# Altium project Arribada-PMP.PrjPCB
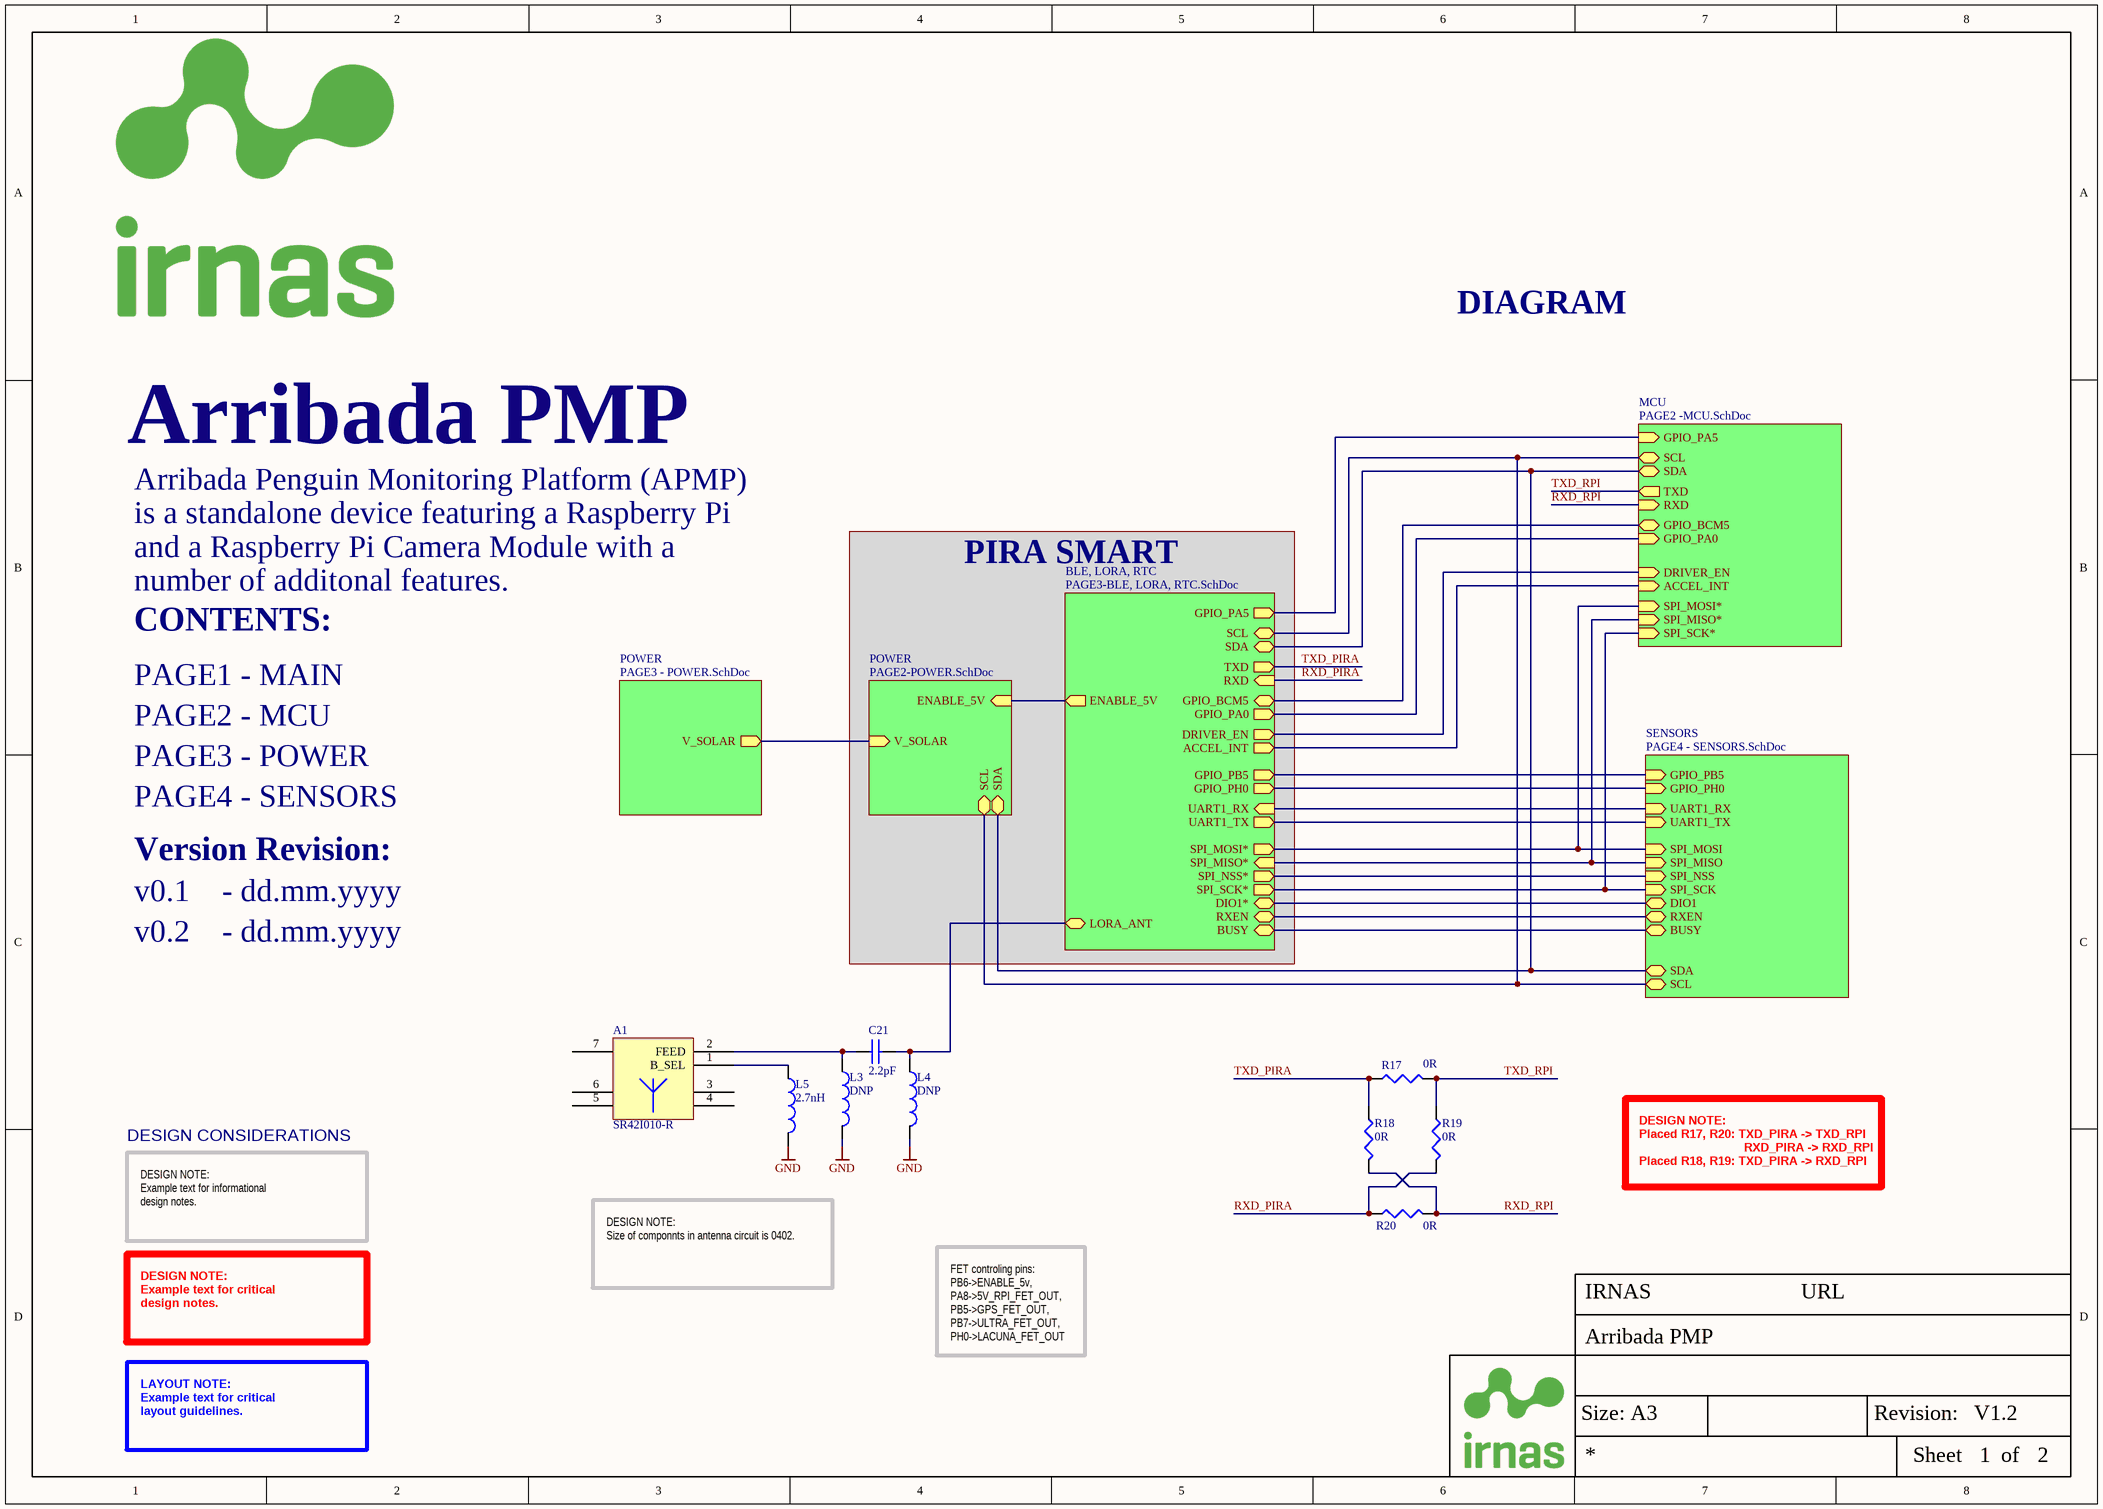
[diagram p0: PAGE1 - MAIN.SchDoc]
Company: IRNAS; CreateDate: 13.09.2019; PCBDesigner: Tadej Plej; ProjectTitle: Arribada PMP; RevisionDate: 14.11.2019; Version: V1.2; Website: URL
4 sheets, 78 parts. Net scope: hierarchical (ports join the sheet entries above them; power ports are global).
Board file: Arribada-PMP-PCB.PcbDoc
Sheets:
  PAGE1 - MAIN.SchDoc
    POWER = PAGE3 - POWER.SchDoc
    SENSORS = PAGE4 - SENSORS.SchDoc
    MCU = PAGE2 -MCU.SchDoc

## Sheet PAGE1 - MAIN.SchDoc
size A3; DocumentNumber: 1; SheetNumber: 1; SheetTotal: 2

### Parts
A1  SR42I010-R  [LORA_PCB_ANTENNA]
C21  2.2pF  [CAP0402]
L3  DNP  [IND0402]
L4  DNP  [IND0402]
L5  2.7nH  [IND0402]
R17  0R  [RES0603]
R18  0R  [RES0603]
R19  0R  [RES0603]
R20  0R  [RES0603]

### Sub-sheets
BLE, LORA, RTC = PAGE3-BLE, LORA, RTC.SchDoc (file not in this document): ENABLE_5V (out), SDA (bidir), UART1_RX (in), SCL (bidir), UART1_TX (out), GPIO_PH0 (out), GPIO_PA5 (out), LORA_ANT (bidir), GPIO_PB5 (out), SPI_MOSI* (out), SPI_MISO* (in), SPI_SCK* (out), DIO1* (bidir), SPI_NSS* (out), TXD (out), RXD (in), GPIO_BCM5 (bidir), RXEN (bidir), BUSY (bidir), GPIO_PA0 (out), DRIVER_EN (out), ACCEL_INT (out)
MCU = PAGE2 -MCU.SchDoc: SDA (bidir), GPIO_PA5 (in), SCL (bidir), TXD (out), GPIO_BCM5 (bidir), RXD (in), GPIO_PA0 (in), DRIVER_EN (in), ACCEL_INT (in), SPI_MISO* (in), SPI_MOSI* (in), SPI_SCK* (in)
POWER = PAGE3 - POWER.SchDoc: V_SOLAR (out)
POWER = PAGE2-POWER.SchDoc (file not in this document): ENABLE_5V (in), SCL (bidir), SDA (bidir), V_SOLAR (in)
SENSORS = PAGE4 - SENSORS.SchDoc: SDA (bidir), GPIO_PH0 (in), UART1_RX (in), SPI_SCK (in), SPI_NSS (in), UART1_TX (in), SCL (bidir), GPIO_PB5 (in), DIO1 (bidir), SPI_MISO (in), SPI_MOSI (in), RXEN (bidir), BUSY (bidir)

### Nets
GND: L3.1 L4.1 L5.1
ACCEL_INT: sheet MCU/ACCEL_INT, sheet BLE, LORA, RTC/ACCEL_INT
BUSY: sheet SENSORS/BUSY, sheet BLE, LORA, RTC/BUSY
DIO1: sheet SENSORS/DIO1, sheet BLE, LORA, RTC/DIO1*
DRIVER_EN: sheet MCU/DRIVER_EN, sheet BLE, LORA, RTC/DRIVER_EN
GPIO_BCM5: sheet MCU/GPIO_BCM5, sheet BLE, LORA, RTC/GPIO_BCM5
GPIO_PA0: sheet MCU/GPIO_PA0, sheet BLE, LORA, RTC/GPIO_PA0
GPIO_PA5: sheet MCU/GPIO_PA5, sheet BLE, LORA, RTC/GPIO_PA5
GPIO_PB5: sheet SENSORS/GPIO_PB5, sheet BLE, LORA, RTC/GPIO_PB5
GPIO_PH0: sheet SENSORS/GPIO_PH0, sheet BLE, LORA, RTC/GPIO_PH0
GPS_RX: sheet SENSORS/UART1_TX, sheet BLE, LORA, RTC/UART1_TX
GPS_TX: sheet SENSORS/UART1_RX, sheet BLE, LORA, RTC/UART1_RX
RXD_PIRA: R19.2 R20.1 ; sheet BLE, LORA, RTC/RXD
RXD_RPI: R18.2 R20.2 ; sheet MCU/RXD
RXEN: sheet SENSORS/RXEN, sheet BLE, LORA, RTC/RXEN
SCL: sheet SENSORS/SCL, sheet MCU/SCL, sheet POWER/SCL, sheet BLE, LORA, RTC/SCL
SDA: sheet SENSORS/SDA, sheet MCU/SDA, sheet POWER/SDA, sheet BLE, LORA, RTC/SDA
SPI_MISO: sheet SENSORS/SPI_MISO, sheet MCU/SPI_MISO*, sheet BLE, LORA, RTC/SPI_MISO*
SPI_MOSI: sheet SENSORS/SPI_MOSI, sheet MCU/SPI_MOSI*, sheet BLE, LORA, RTC/SPI_MOSI*
SPI_NSS: sheet SENSORS/SPI_NSS, sheet BLE, LORA, RTC/SPI_NSS*
SPI_SCK: sheet SENSORS/SPI_SCK, sheet MCU/SPI_SCK*, sheet BLE, LORA, RTC/SPI_SCK*
TXD_PIRA: R17.1 R18.1 ; sheet BLE, LORA, RTC/TXD
TXD_RPI: R17.2 R19.1 ; sheet MCU/TXD
V_SOLAR: sheet POWER/V_SOLAR, sheet POWER/V_SOLAR
NetA1_1: A1.1(B_SEL) L5.2
NetA1_2: A1.2(FEED) C21.1 L3.2
NetC21_2: C21.2 L4.2 ; sheet BLE, LORA, RTC/LORA_ANT
(unnamed): sheet POWER/ENABLE_5V, sheet BLE, LORA, RTC/ENABLE_5V

Not connected (* = marked no-connect by the designer): A1 3 4 5 6 7

### Notes on the sheet
- DIAGRAM
- Arribada Penguin Monitoring Platform (APMP)
- is a standalone device featuring a Raspberry Pi
- and a Raspberry Pi Camera Module with a
- PIRA SMART
- CONTENTS:
- number of additonal features.
- PAGE1 - MAIN
- PAGE2 - MCU
- PAGE3 - POWER
- PAGE4 - SENSORS
- Version Revision:
- v0.1    - dd.mm.yyyy
- v0.2    - dd.mm.yyyy
- DESIGN CONSIDERATIONS
- DESIGN NOTE:
  Placed R17, R20: TXD_PIRA -> TXD_RPI
  RXD_PIRA -> RXD_RPI
  Placed R18, R19: TXD_PIRA -> RXD_RPI
  RXD_PIRA -> TXD_RPI
- DESIGN NOTE:
  Example text for informational
  design notes.
- DESIGN NOTE:
  Example text for critical
  design notes.
- DESIGN NOTE:
  Size of componnts in antenna circuit is 0402.
- FET controling pins:
  PB6->ENABLE_5v,
  PA8->5V_RPI_FET_OUT,
  PB5->GPS_FET_OUT,
  PB7->ULTRA_FET_OUT,
  PH0->LACUNA_FET_OUT
- LAYOUT NOTE:
  Example text for critical
  layout guidelines.
- Size: A3
- Revision:
- Sheet
- of

### Library data of the parts
A1 = ANT - SR42I010-R_1: Antenna SMD -4dBi Gain 870MHz/928MHz Automotive 7-Pin SMD T/R; Manufacturer: Antenova; Supplier 1: Mouser; Manufacturer Part Number: SR42I010-R; Stock 1: 3154; Pricing 1: 1 = 2.36000, 10 = 1.90000, 50 = 1.90000, 100 = 1.52000, 1000 = 1.07000, 10000 = 0.95900 (USD); Supplier Part Number 1: 237-SR42I010-R
C21 = C - 1.8pF/0402: Multilayer Ceramic Capacitors MLCC - SMD/SMT 50volts 1.8pF C0G; Manufacturer: KEMET; Manufacturer Part Number: C0402C189B5GACTU; IRNAS Part No.: /; Voltage Rating: 50V; Stock 1: 8950; Pricing 1: 10=0.463, 100=0.248, 500=0.182, 2500=0.153, 5000=0.134, 10000=0.11, 50000=0.0961 (EUR); Case/Package: 0402; Case Code (Imperial): 0402; Case Code (Metric): 1005; Dielectric Material: Ceramic; Min Operating Temperature: -55°C; Max Operating Temperature: 125°C; Packaging: Tape and Reel; Voltage Rating (DC): 50V; Capacitance: 1.8pF; Termination: SMD/SMT; Lead Free: Lead Free; ComponentLink1URL: https://datasheet.ciiva.com/5413/kem-c1003-c0g-smd-5413366.pdf; ComponentLink1Description: https://datasheet.ciiva.com/5413/kem-c1003-c0g-smd-5413366.pdf; Supplier 1: Farnell; Supplier Part Number 1: 2627398
L3-L5 = L - 4.3nH/0402: Inductor RF Chip Multi-Layer 4.3nH 0.3nH 100MHz 8Q-Factor Air 300mA 210mOhm DCR 0402 Paper T/R; Manufacturer: Murata; Manufacturer Part Number: LQG15HN4N3S02D; IRNAS Part No.: /; Q Factor: 8; Self Resonant Frequency: 6GHz; Shielding: Unshielded; DC Resistance (DCR): 210mR; Stock 1: 3502; Pricing 1: 1 = 0.10000, 10 = 0.06100, 100 = 0.04040, 500 = 0.03366, 1000 = 0.02827, 2500 = 0.02423 (USD); RoHS: Yes; Mount: Surface Mount; Case/Package: 0402; Core Material: Air; Case Code (Metric): 1005; Case Code (Imperial): 0402; Min Operating Temperature: -55°C; Max Operating Temperature: 125°C; Package Quantity: 10000; Packaging: Tape and Reel; Current Rating: 300mA; Inductance: 4.3nh; Test Frequency: 100MHz; Max DC Current: 300mA; Termination: SMD/SMT; Current: 300mA; DC Current: 300mA; Military Standard: Not; Length: 1.05mm; Height: 0.5mm; Width: 0.02inch; Height - Seated (Max): 0.022inch; Depth: 0.55mm; Radiation Hardening: No; REACH SVHC: No SVHC; Lead Free: Lead Free; ComponentLink1URL: http://uk.rs-online.com/webdocs/0f10/0900766b80f10808.pdf?src-supplier=RSComponents; ComponentLink1Description: http://uk.rs-online.com/webdocs/0f10/0900766b80f10808.pdf?src-supplier=RSComponents; ComponentLink2URL: http://search.murata.co.jp/Ceramy/image/img/PDF/ENG/L0075S0083LQG15HN.pdf?src-supplier=Avnet; ComponentLink2Description: http://search.murata.co.jp/Ceramy/image/img/PDF/ENG/L0075S0083LQG15HN.pdf?src-supplier=Avnet; ComponentLink3URL: http://www.farnell.com/datasheets/66026.pdf?src-supplier=Element14; ComponentLink3Description: http://www.farnell.com/datasheets/66026.pdf?src-supplier=Element14; ComponentLink4URL: https://www.verical.com/server-webapp/html/getDatasheet?partID=31252&src-supplier=Verical; ComponentLink4Description: https://www.verical.com/server-webapp/html/getDatasheet?partID=31252&src-supplier=Verical; ComponentLink5URL: http://search.murata.co.jp/Ceramy/image/img/PDF/ENG/L0075S0083LQG15HN.pdf?src-supplier=Avnet+Europe; ComponentLink5Description: http://search.murata.co.jp/Ceramy/image/img/PDF/ENG/L0075S0083LQG15HN.pdf?src-supplier=Avnet+Europe; ComponentLink6URL: https://search.murata.co.jp/Ceramy/image/img/P02/partnumberingAT_LQ3E.pdf?src-supplier=Digi-Key; ComponentLink6Description: https://search.murata.co.jp/Ceramy/image/img/P02/partnumberingAT_LQ3E.pdf?src-supplier=Digi-Key; Supplier 1: Farnell
  L3 L4: Supplier Part Number 1: 1711735
  L5: Supplier Part Number 1: 1343066
R17-R20 = R - 0R: BOURNS - CR0603-J/-000ELF - RES, THICK FILM, 0R, 5%, 0.1W, 0603; IRNAS Part No.: I-100011; Resistance: 0; Voltage Rating: 50; Resistor Case Style: 0603 [1608 Metric]; Power Rating: 100; Product Range: CR Series; SVHC: No SVHC (17-Dec-2015); Resistor Mounting: Surface Mount Device<!--FANDB--><div class="features-and-benefits-container"><div class="features-and-benefits-description"><span class="features-benefits-value">The Bourns CR series are standard thick film chip resistors. These resistors provide flexibility of performance, space saving and low cost. The Resistance range includes E96 and E24 decade values from 1ohm to 10Mohm.</span></div><div class="features-and-benefits-list"><ul class="features-and-benefits-list-list"><li class="features-and-benefits-list-item">0201, 0402, 0603, 0805, 1206, 1210, 2010, 2512 standard case sizes available</li><li class="features-and-benefits-list-item">±1% and ±5% tolerance</li><li class="features-and-benefits-list-item">±100ppm/°C, ±200ppm/°C and ±250ppm/°C TCR values available</li><li class="features-and-benefits-list-item">Power rating selectable for 50mW, 63mW, 0.1W, 0.125W, 0.25W, 0.5W and 1W based on ordering</li><li class="features-and-benefits-list-item">Jumpers are available for all size</li><li class="features-and-benefits-list-item">3 layer termination process with nickel barrier prevents leaching & provides excellent solderability</li><li class="features-and-benefits-list-item">Suitable for all type of soldering processes</li><li class="features-and-benefits-list-item">Tight dimensional tolerances</li><li class="features-and-benefits-list-item">Maximum working voltage depends on case size</li><li class="features-and-benefits-list-item">Operating temperature of -55°C to +125°C(CR0201) and -55°C to +155; Supplier 1: Farnell; Manufacturer: BOURNS; Manufacturer Part Number: CR0603-J/-000ELF; RoHS: YES; Stock 1: 58200; Pricing 1: 10=0.0146, 250=0.0097, 1000=0.0073, 5000=0.0049, 12500=0.0042 (GBP); Resistance Tolerance: ± 5%; Packaging: Cut Tape; Resistor Element Material: Thick Film; Temperature Coefficient: -; Automotive Qualification Standard: -; MSL: MSL 1 - Unlimited; ComponentLink1URL: http://www.bourns.com/engineering/CHPREZTR/cr0603.stp; ComponentLink1Description: http://www.bourns.com/engineering/CHPREZTR/cr0603.stp; ComponentLink2URL: http://www.farnell.com/datasheets/2178762.pdf; ComponentLink2Description: http://www.farnell.com/datasheets/2178762.pdf; Supplier Part Number 1: 2008343

## Sheet PAGE3 - POWER.SchDoc
size A3; DocumentNumber: 1; SheetNumber: 3; SheetTotal: 2
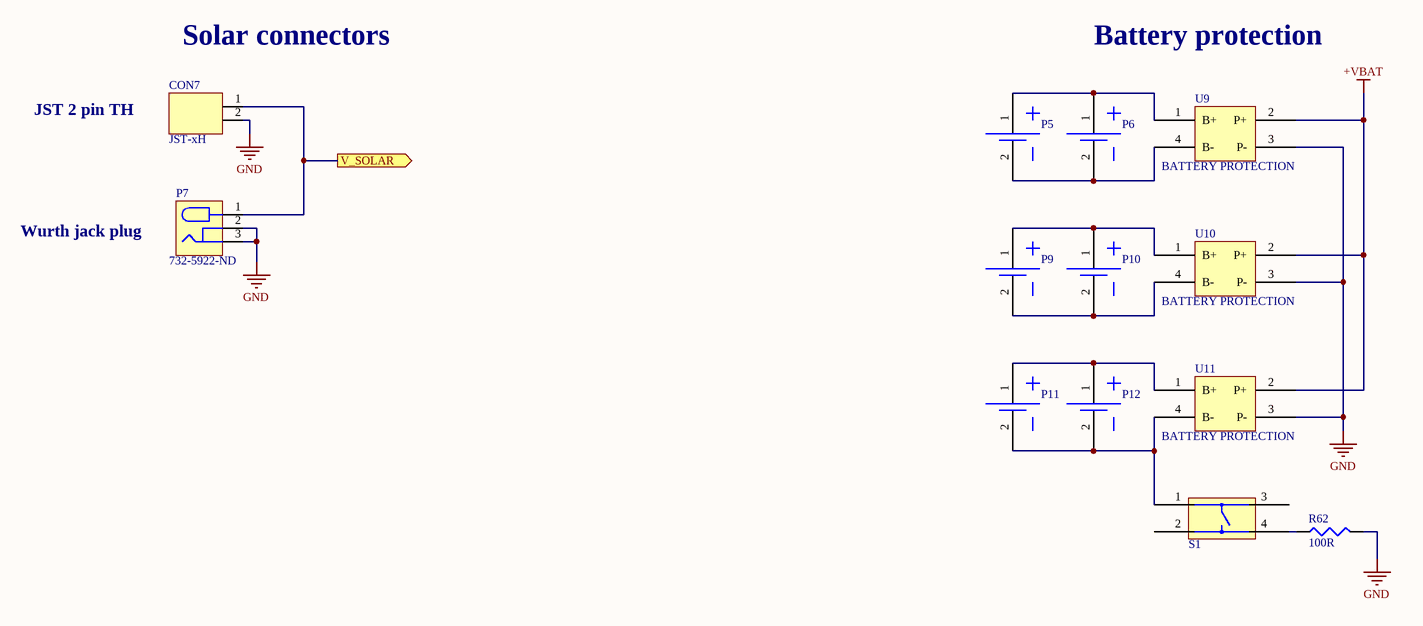
[diagram p1: PAGE3 - POWER.SchDoc]

### Parts
CON7  JST-xH  [JST_2PIN_TH]
P5  BAT - 18650  [BATTERY HOLDER 18650]  (value not drawn)
P6  BAT - 18650  [BATTERY HOLDER 18650]  (value not drawn)
P7  732-5922-ND  [732-5922-ND]
P9  BAT - 18650  [BATTERY HOLDER 18650]  (value not drawn)
P10  BAT - 18650  [BATTERY HOLDER 18650]  (value not drawn)
P11  BAT - 18650  [BATTERY HOLDER 18650]  (value not drawn)
P12  BAT - 18650  [BATTERY HOLDER 18650]  (value not drawn)
R62  100R  [RES0603]
S1  BTN - KMR221NGLFS  [SW]  (value not drawn)
U9  BATTERY PROTECTION  [BATTERY PROTECTION]
U10  BATTERY PROTECTION  [BATTERY PROTECTION]
U11  BATTERY PROTECTION  [BATTERY PROTECTION]

### Ports
V_SOLAR (out)

### Nets
+VBAT: U9.2(P+) U10.2(P+) U11.2(P+)
GND: CON7.2 P7.2 P7.3 R62.2 U9.3(P-) U10.3(P-) U11.3(P-)
V_SOLAR: CON7.1 P7.1 ; port V_SOLAR
NetP5_1: P5.1 P6.1 U9.1(B+)
NetP5_2: P5.2 P6.2 U9.4(B-)
NetP9_1: P9.1 P10.1 U10.1(B+)
NetP9_2: P9.2 P10.2 U10.4(B-)
NetP11_1: P11.1 P12.1 U11.1(B+)
NetP11_2: P11.2 P12.2 S1.1 U11.4(B-)
NetR62_1: R62.1 S1.4

Not connected (* = marked no-connect by the designer): S1 2 3

### Notes on the sheet
- Solar connectors
- Battery protection
- JST 2 pin TH
- Wurth jack plug
- Size: A3
- Revision:
- Sheet
- of

### Library data of the parts
CON7 = B2B-XH-A (LF)(SN): Wire-To-Board Connector, Vertical, 2.5 mm, 2 Contacts, Header, XH Series, Through Hole, 1 Rows; ComponentLink1Description: Datasheet; ComponentLink1URL: http://www.farnell.com/datasheets/2057209.pdf?_ga=2.26100990.2144023421.1568612611-1741076818.1563951383; Supplier 1: Farnell; Supplier Part Number 1: 1516276
P5 P6 P9-P12 = BAT - 18650: BATERRY HOLDER 18650; Supplier Part Number 1: Battery holder for 18650
P7 = CONN PWR JACK 1.05X3.5MM: Power Barrel Connector Jack 1.05mm ID (0.041"), 3.50mm OD (0.138") Through Hole, Right Angle; ComponentLink1Description: Datasheet; ComponentLink1URL: https://katalog.we-online.de/em/datasheet/6941xx303002.pdf; Supplier 1: Farnell; Supplier Part Number 1: 2472141
R62 = R - 100R: MULTICOMP - MC0063W06031100R - RES, THICK FILM, 100R, 1%, 0.063W, 0603; IRNAS Part No.: I-100009; Resistance: 100; Voltage Rating: 50; Resistor Case Style: 0603 [1608 Metric]; Power Rating: 63; Product Range: MC Series; Temperature Coefficient: ± 200; SVHC: No SVHC (12-Jan-2017); External Depth: 0.45; External Length / Height: 1.6; External Width: 0.8; No. of Pins: 2; Reel Quantity: 5000; Resistor Mounting: Surface Mount Device; Temperature Coeff. +: 200; Voltage Rating V DC: 50V<!--FANDB--><div class="features-and-benefits-container"><div class="features-and-benefits-description"><span class="features-benefits-value">The Multicomp MC series current sense resistors are thick film chip resistors. The resistance range includes E96 and E24 decade values from 1ohm to 10Mohm.</span></div><div class="features-and-benefits-list"><ul class="features-and-benefits-list-list"><li class="features-and-benefits-list-item">EIA 0402, 0603, 0805, 1206 chip sizes available</li><li class="features-and-benefits-list-item">Small size and low weight</li><li class="features-and-benefits-list-item">Suitable for both wave and reflow soldering</li><li class="features-and-benefits-list-item">Reduction of assembly costs</li><li class="features-and-benefits-list-item">Maximum working voltage of 50V(0402, 0603), 150V(0805), 200V(1206)</li><li class="features-and-benefits-list-item">Available in ±1%, ±2% and ±5% tolerance</li><li class="features-and-benefits-list-item">Power rating of 62.5mW, 100mW and 125mW</li><li class="features-and-benefits-list-item">±400ppm/°C(1ohm to 10ohm), ±200ppm/°C(11ohm to 100ohm), ±100; Supplier 1: Farnell; Manufacturer: MULTICOMP; Manufacturer Part Number: MC0063W06031100R; RoHS: Y-EX; Stock 1: 78152; Pricing 1: 10=0.0011, 100=0.001, 500=0.0009, 1000=0.0008, 2500=0.0007 (GBP); Resistance Tolerance: ± 1%; Packaging: Cut Tape; Resistor Element Material: Thick Film; Automotive Qualification Standard: -; Operating Temperature Max: 155; Operating Temperature Min: -55; Operating Temperature Range: -55°C to +155; Tape Width: 8; Temperature Coeff. -: 200; Tolerance +: 1%; Tolerance -: 1%; ComponentLink1URL: http://www.farnell.com/datasheets/1788326.pdf; ComponentLink1Description: http://www.farnell.com/datasheets/1788326.pdf; ComponentLink2URL: http://www.farnell.com/cad/1561149.zip; ComponentLink2Description: http://www.farnell.com/cad/1561149.zip; ComponentLink3URL: http://www.farnell.com/datasheets/2289252.pdf; ComponentLink3Description: http://www.farnell.com/datasheets/2289252.pdf; Supplier Part Number 1: 9330364
S1 = BTN - KMR221NGLFS: SWITCH TACTILE SPST-NO 0.05A 32V; Manufacturer: ITT C&K; Mechanical Life: 200000Cycles; Throw Configuration: SPST; Operating Force: 2N; Max Current Rating: 50mA; Power Rating: 1W; Illumination Type: Non-Illuminated; Switch Travel: 0.25mm; Switch Function: Off-Mom; Actuator Type: Standard; Actuator Length: 0.5mm; Supplier 1: Farnell; Manufacturer Part Number: KMR221NGLFS; Stock 1: 3038; Pricing 1: 10 = 0.29100, 500 = 0.27600, 1000 = 0.21800, 5000 = 0.18500, 10000 = 0.18100 (GBP); RoHS: Yes; Mount: Surface Mount; Case/Package: SMD/SMT; Contact Material: Silver; Contact Plating: Silver; Min Operating Temperature: -40°C; Max Operating Temperature: 85°C; Voltage Rating (DC): 32V; Packaging: Tape and Reel; Package Quantity: 1; Max Voltage Rating (DC): 32V; Current Rating: 50mA; Termination: Gull Wing; Orientation: Straight; Length: 2.8mm; Depth: 4.6mm; Radiation Hardening: No; Lead Free: Lead Free; ComponentLink1URL: https://www.ckswitches.com/media/1479/kmr2.pdf?src-supplier=Digi-Key; ComponentLink1Description: https://www.ckswitches.com/media/1479/kmr2.pdf?src-supplier=Digi-Key; ComponentLink2URL: http://www.ck-components.com/14414/kmr2_9aug12.pdf/?src-supplier=Avnet+Europe; ComponentLink2Description: http://www.ck-components.com/14414/kmr2_9aug12.pdf/?src-supplier=Avnet+Europe; ComponentLink3URL: http://www1.futureelectronics.com/doc/C%20-%20K%20COMPONENTS/KMR221NGLFS.pdf?src-supplier=Future+Electronics; ComponentLink3Description: http://www1.futureelectronics.com/doc/C%20-%20K%20COMPONENTS/KMR221NGLFS.pdf?src-supplier=Future+Electronics; Supplier Part Number 1: 2845727
U9-U11 = BATTERY PROTECTION: Supplier Part Number 1: Battery protection

## Sheet PAGE4 - SENSORS.SchDoc
size A3; DocumentNumber: 1; SheetNumber: 4; SheetTotal: 2
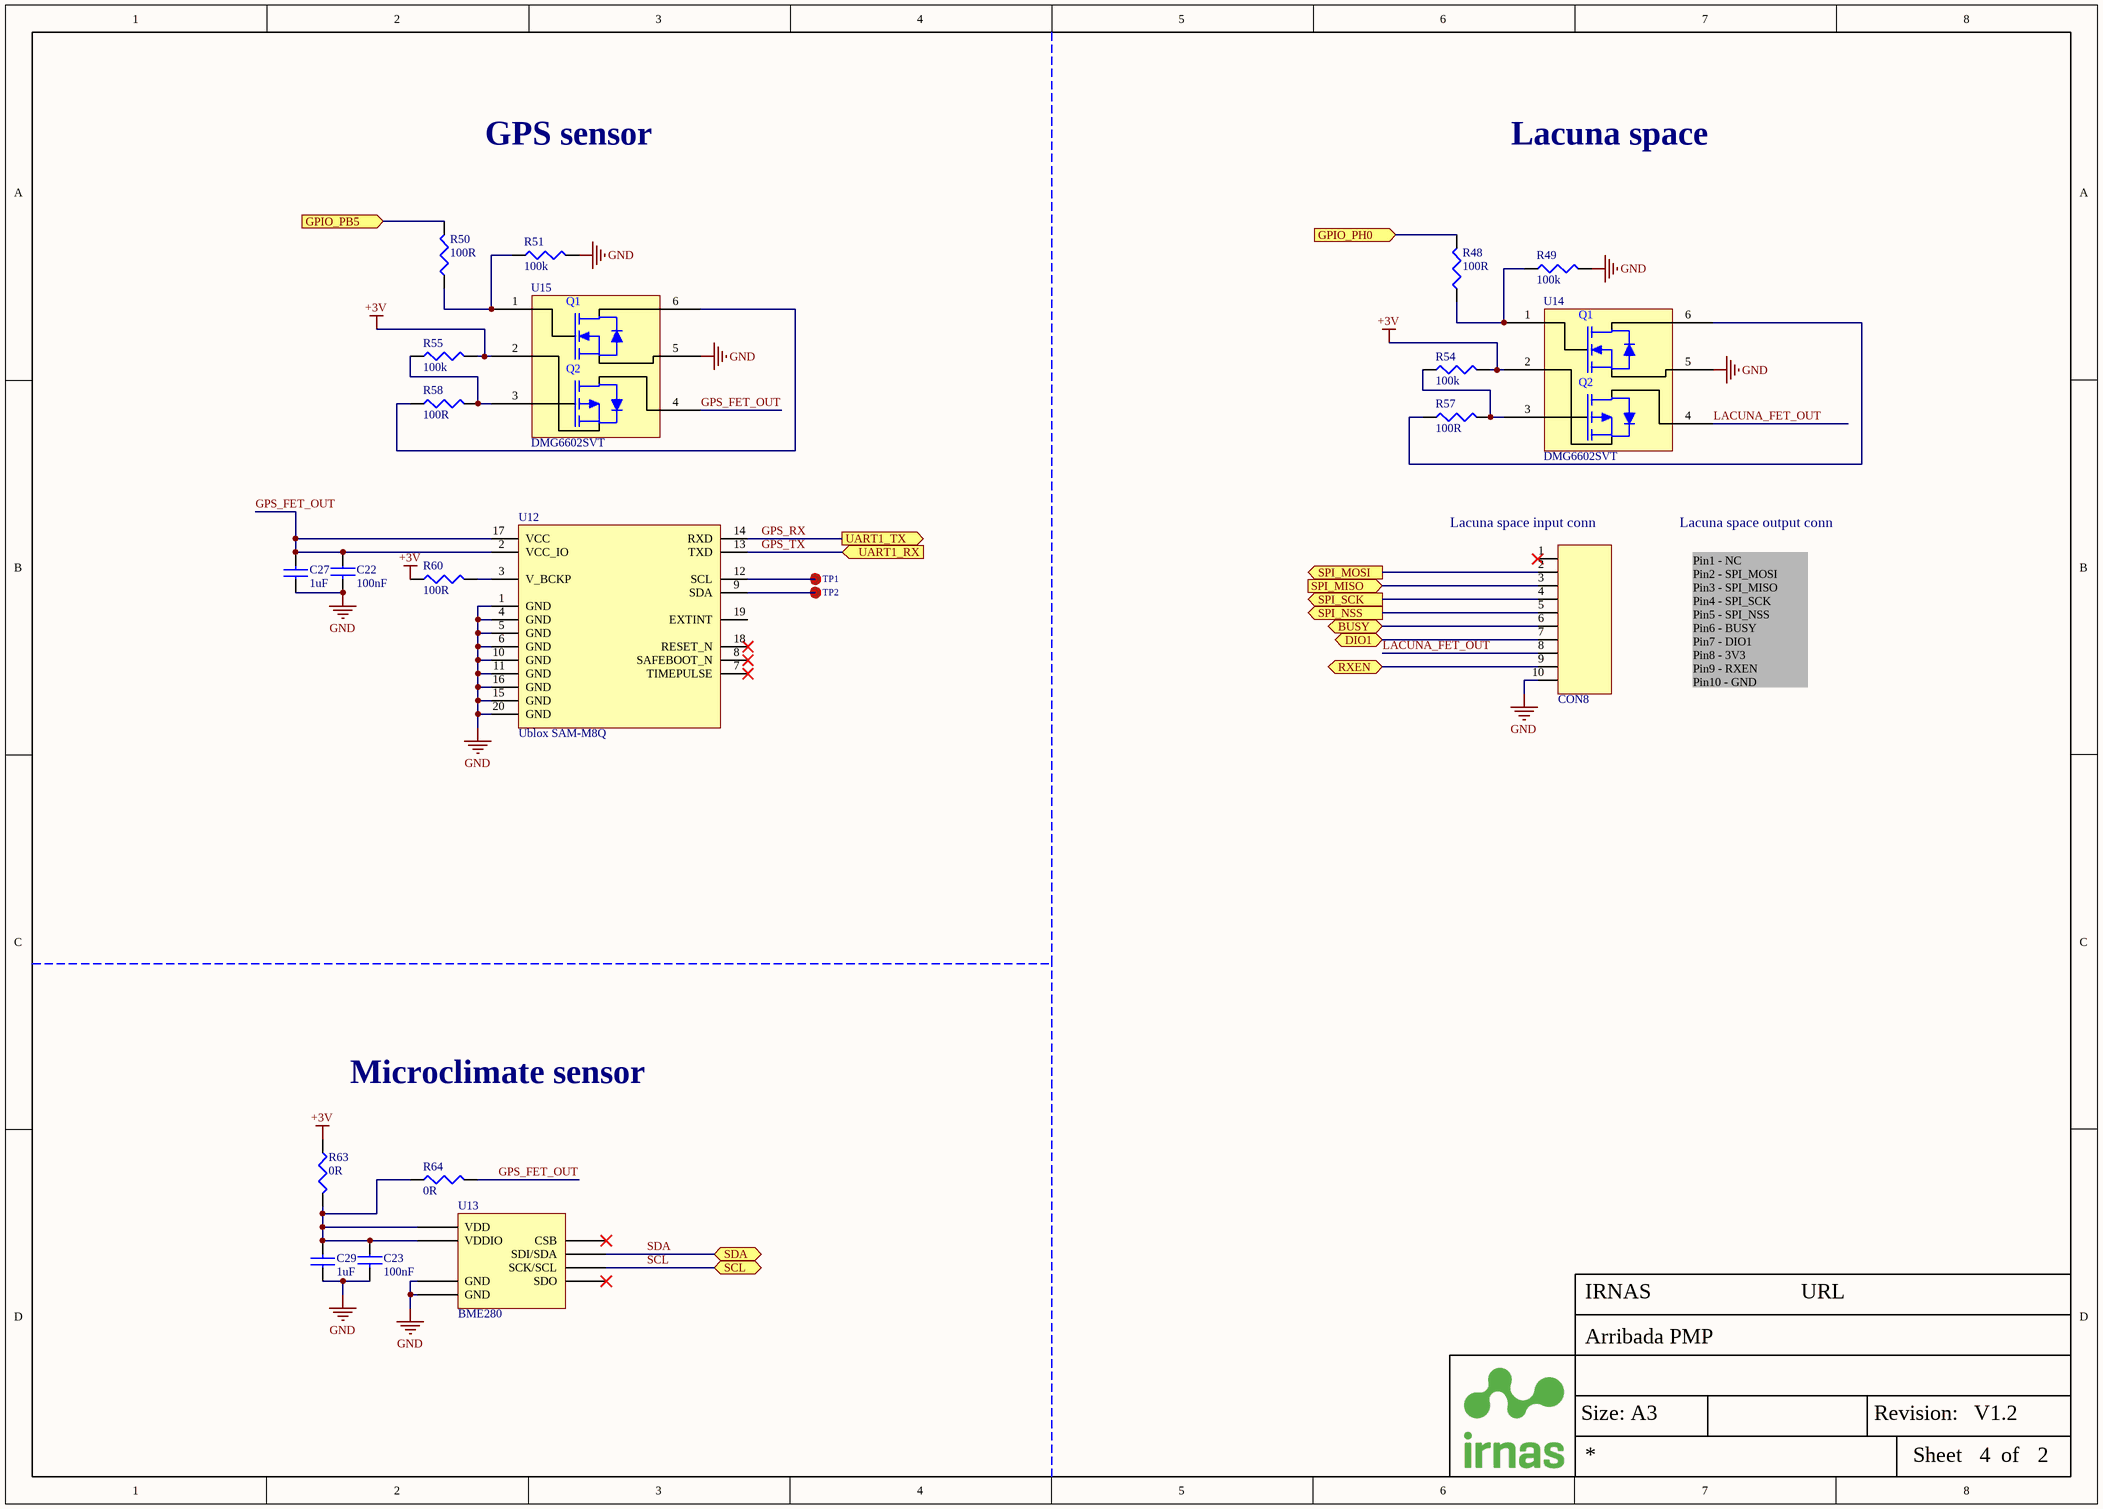
[diagram p2: PAGE4 - SENSORS.SchDoc]

### Parts
C22  100nF  [CAP0603]
C23  100nF  [CAP0603]
C27  1uF  [CAP0603]
C29  1uF  [CAP0603]
CON8  53261-1071  [PICOBLADE 10PIN]  (value not drawn)
R48  100R  [RES0603]
R49  100k  [RES0603]
R50  100R  [RES0603]
R51  100k  [RES0603]
R54  100k  [RES0603]
R55  100k  [RES0603]
R57  100R  [RES0603]
R58  100R  [RES0603]
R60  100R  [RES0603]
R63  0R  [RES0603]
R64  0R  [RES0603]
TP1  TestPoint  [TestPoint:1.2x1.2mm]  (value not drawn)
TP2  TestPoint  [TestPoint:1.2x1.2mm]  (value not drawn)
U12  Ublox SAM-M8Q  [SAM-M8Q]
U13  BME280  [BME280]
U14  DMG6602SVT  [TSOT26]
U15  DMG6602SVT  [TSOT26]

### Ports
BUSY (bidir), DIO1 (bidir), GPIO_PB5 (in), GPIO_PH0 (in), RXEN (bidir), SCL (bidir), SDA (bidir), SPI_MISO (in), SPI_MOSI (out), SPI_NSS (out), SPI_SCK (out), UART1_RX (in), UART1_TX (out)

### Nets
+3V: R54.2 R55.2 R60.1 R63.1 U14.2(S2) U15.2(S2)
GND: C22.2 C23.2 C27.1 C29.1 CON8.10 R49.2 R51.2 U12.1(GND) U12.4(GND) U12.5(GND) U12.6(GND) U12.10(GND) U12.11(GND) U12.15(GND) U12.16(GND) U12.20(GND) U13.1(GND) U13.7(GND) U14.5(S1) U15.5(S1)
BUSY: CON8.6 ; port BUSY
DIO1: CON8.7 ; port DIO1
GPIO_PB5: R50.2 ; port GPIO_PB5
GPIO_PH0: R48.2 ; port GPIO_PH0
GPS_FET_OUT: C22.1 C27.2 R64.2 U12.2(VCC_IO) U12.17(VCC) U15.4(D2)
GPS_RX: U12.14(RXD) ; port UART1_TX
GPS_TX: U12.13(TXD) ; port UART1_RX
LACUNA_FET_OUT: CON8.8 U14.4(D2)
RXEN: CON8.9 ; port RXEN
SCL: U13.4(SCK/SCL) ; port SCL
SDA: U13.3(SDI/SDA) ; port SDA
SPI_MISO: CON8.3 ; port SPI_MISO
SPI_MOSI: CON8.2 ; port SPI_MOSI
SPI_NSS: CON8.5 ; port SPI_NSS
SPI_SCK: CON8.4 ; port SPI_SCK
NetC23_1: C23.1 C29.2 R63.2 R64.1 U13.6(VDDIO) U13.8(VDD)
NetR48_1: R48.1 R49.1 U14.1(G1)
NetR50_1: R50.1 R51.1 U15.1(G1)
NetR54_1: R54.1 R57.2 U14.3(G2)
NetR55_1: R55.1 R58.2 U15.3(G2)
NetR57_1: R57.1 U14.6(D1)
NetR58_1: R58.1 U15.6(D1)
NetR60_2: R60.2 U12.3(V_BCKP)
NetTP1_0: TP1.0 U12.12(SCL)
NetTP2_0: TP2.0 U12.9(SDA)

Not connected (* = marked no-connect by the designer): CON8 1*; U12 7(TIMEPULSE)* 8(SAFEBOOT_N)* 18(RESET_N)* 19(EXTINT); U13 2(CSB)* 5(SDO)*

### Notes on the sheet
- GPS sensor
- Lacuna space
- (near CON8) Lacuna space input conn
- Lacuna space output conn
- Pin1 - NC
  Pin2 - SPI_MOSI
  Pin3 - SPI_MISO
  Pin4 - SPI_SCK
  Pin5 - SPI_NSS
  Pin6 - BUSY
  Pin7 - DIO1
  Pin8 - 3V3
  Pin9 - RXEN
  Pin10 - GND
- Microclimate sensor
- Size: A3
- Revision:
- Sheet
- of
- (in symbol T_M - DMG6602SVT) Q1; Q2

### Library data of the parts
C22 C23 = C - 100nF: MURATA - GRM188R71C104KA01J - CAP, MLCC, X7R, 0.1UF, 16V, 0603; IRNAS Part No.: I-200005; Ceramic Capacitor Case: 0603 [1608 Metric]; Capacitance: 0.1; Voltage Rating: 16; Capacitance Tolerance: ± 10%; Dielectric Characteristic: X7; Product Range: GRM Series; SVHC: No SVHC (20-Jun-2016; Supplier 1: Farnell; Manufacturer: MURATA; Manufacturer Part Number: GRM188R71C104KA01J; RoHS: YES; Stock 1: 18297; Pricing 1: 10=0.0145, 100=0.0126, 500=0.0081, 2500=0.0059, 5000=0.0052, 10000=0.0046, 50000=0.0036, 100000=0.0035 (GBP); Packaging: Cut Tape; Operating Temperature Min: -55; Operating Temperature Max: 125; Automotive Qualification Standard: -; MSL: MSL 1 - Unlimited; ComponentLink1URL: http://www.farnell.com/datasheets/2189124.pdf; ComponentLink1Description: http://www.farnell.com/datasheets/2189124.pdf; Supplier Part Number 1: 2688519
C27 C29 = C - 1uF: MURATA - GRM188R61H105KAALD - CAP, MLCC, X5R, 1UF, 50V, 0603; IRNAS Part No.: I-200006; Ceramic Capacitor Case: 0603 [1608 Metric]; Capacitance: 1; Voltage Rating: 50; Capacitance Tolerance: ± 10%; Dielectric Characteristic: X5; Product Range: GRM Series; SVHC: No SVHC (17-Dec-2015); Capacitor Terminals: SMD<!--FANDB--><div class="features-and-benefits-container"><div class="features-and-benefits-description"><span class="features-benefits-value">The Murata GRM series capacitors are Multilayer Ceramic Chip Capacitors (MLCC) used for general purpose applications. These MLCC capacitors are classified into temperature compensating and high dielectric constant types depending on the change in electrostatic capacitance due to change in temperature. The temperature compensating capacitors feature a small rate of change in electrostatic capacitance as the temperature changes and are used for applications such as filters and high frequency circuit matching. The high dielectric constant capacitors use materials with a high dielectric constant and feature a large electrostatic capacitance. Typical applications are power supply decoupling and smoothing circuits.</span></div><div class="features-and-benefits-list"><ul class="features-and-benefits-list-list"><li class="features-and-benefits-list-item">Large capacity and small size in a multilayer structure</li><li class="features-and-benefits-list-item">Capacitance value ranging from 0.1pF to 220?F</li><li class="features-and-benefits-list-item">Tin plated external electrodes, excellent solderability</li><li class="features-and-benefits-list-item">Provides good high frequency characteristics</li><li class="features-and-benefits-list-item">Excellent pulse response</li><li class="features-and-benefits-list-item">High reliability</li><li class="features-and-benefits-list-item">Capacitor size varies from 0.4×0.2mm to 5.7×5.0mm</li><li class="features-and-benefits-list-item">Rated voltage of 2.5VDC to 3.15; Supplier 1: Farnell; Manufacturer: MURATA; Manufacturer Part Number: GRM188R61H105KAALD; RoHS: YES; Stock 1: 62682; Pricing 1: 10=0.093, 100=0.062, 500=0.0507, 1000=0.0465, 2000=0.0429, 4000=0.0399, 20000=0.0372, 40000=0.0365 (GBP); Packaging: Cut Tape; Operating Temperature Min: -55; Operating Temperature Max: 85; Automotive Qualification Standard: -; MSL: -; Capacitance Tolerance ±: ± 10%; ComponentLink1URL: http://www.farnell.com/datasheets/2048611.pdf; ComponentLink1Description: http://www.farnell.com/datasheets/2048611.pdf; Supplier Part Number 1: 1845736
CON8 = PicoBlade 10pin: Wire-To-Board Connector, Right Angle, 1.25 mm, 10 Contacts, Header, PicoBlade 53261 Series; ComponentLink1Description: Datasheet; ComponentLink1URL: http://www.farnell.com/datasheets/2697773.pdf?_ga=2.235245378.2144023421.1568612611-1741076818.1563951383; Supplier 1: Farnell; Supplier Part Number 1: 1125377
R48 R50 R57 R58 R60 = R - 100R: as R62 on sheet PAGE3 - POWER; Supplier 1: Farnell; Manufacturer: MULTICOMP; Manufacturer Part Number: MC0063W06031100R; RoHS: Y-EX; Stock 1: 78152; Pricing 1: 10=0.0011, 100=0.001, 500=0.0009, 1000=0.0008, 2500=0.0007 (GBP); Resistance Tolerance: ± 1%; Packaging: Cut Tape; Resistor Element Material: Thick Film; Automotive Qualification Standard: -; Operating Temperature Max: 155; Operating Temperature Min: -55; Operating Temperature Range: -55°C to +155; Tape Width: 8; Temperature Coeff. -: 200; Tolerance +: 1%; Tolerance -: 1%; ComponentLink1URL: http://www.farnell.com/datasheets/1788326.pdf; ComponentLink1Description: http://www.farnell.com/datasheets/1788326.pdf; ComponentLink2URL: http://www.farnell.com/cad/1561149.zip; ComponentLink2Description: http://www.farnell.com/cad/1561149.zip; ComponentLink3URL: http://www.farnell.com/datasheets/2289252.pdf; ComponentLink3Description: http://www.farnell.com/datasheets/2289252.pdf; Supplier Part Number 1: 9330364
R49 R51 R54 R55 = R - 100k: MULTICOMP - MCMR06X104 JTL - RES, CERAMIC, 100K, 5%, 0.1W, 0603; IRNAS Part No.: I-100007; Resistance: 100; Voltage Rating: 75; Resistor Case Style: 0603 [1608 Metric]; Product Range: MCMR Series; Temperature Coefficient: ± 100; Resistor Mounting: Surface Mount Device<!--FANDB--><div class="features-and-benefits-container"><div class="features-and-benefits-description"><span class="features-benefits-value">The Multicomp MCMR series resistors are automotive grade, anti sulphured thick film chip resistor. The resistance range includes E24 and E96 decade values from 1ohm to 10Mohm. These resistors are constructed on top of a high grade ceramic body.</span></div><div class="features-and-benefits-list"><ul class="features-and-benefits-list-list"><li class="features-and-benefits-list-item">EIA 0402, 0603, 0805, 1206 chip sizes available</li><li class="features-and-benefits-list-item">High reliability and stability</li><li class="features-and-benefits-list-item">Automotive grade AEC-Q200 compliant</li><li class="features-and-benefits-list-item">Complaint with (IEC 60068-1) 55/155/56 climatic category</li><li class="features-and-benefits-list-item">Maximum operation voltage of 50V, 75V, 150V and 200V</li><li class="features-and-benefits-list-item">Power rating of 62.5mW, 100mW, 125mW and 250mW</li><li class="features-and-benefits-list-item">Available in ±1% and ±5% tolerance</li><li class="features-and-benefits-list-item">Temperature coefficient (TCR) of +200ppm/°C, +100ppm/°C and -200ppm/°C to +400ppm/°C</li><li class="features-and-benefits-list-item">Operating temperature range -55°C to 155; Supplier 1: Farnell; Manufacturer: MULTICOMP; Manufacturer Part Number: MCMR06X104 JTL; RoHS: Y-EX; Stock 1: 187; Pricing 1: 10=0.0109, 100=0.0085, 500=0.006, 1000=0.0048, 2500=0.004, 5000=0.003, 25000=0.002, 50000=0.0016 (GBP); Power Rating: 100; Resistance Tolerance: ± 5%; Packaging: Cut Tape; Resistor Element Material: Ceramic; Automotive Qualification Standard: -; ComponentLink1URL: http://www.farnell.com/datasheets/1716707.pdf; ComponentLink1Description: http://www.farnell.com/datasheets/1716707.pdf; Supplier Part Number 1: 2073357
R63 R64 = R - 0R: as R17 on sheet PAGE1 - MAIN; Supplier 1: Farnell; Manufacturer: BOURNS; Manufacturer Part Number: CR0603-J/-000ELF; RoHS: YES; Stock 1: 58200; Pricing 1: 10=0.0146, 250=0.0097, 1000=0.0073, 5000=0.0049, 12500=0.0042 (GBP); Resistance Tolerance: ± 5%; Packaging: Cut Tape; Resistor Element Material: Thick Film; Temperature Coefficient: -; Automotive Qualification Standard: -; MSL: MSL 1 - Unlimited; ComponentLink1URL: http://www.bourns.com/engineering/CHPREZTR/cr0603.stp; ComponentLink1Description: http://www.bourns.com/engineering/CHPREZTR/cr0603.stp; ComponentLink2URL: http://www.farnell.com/datasheets/2178762.pdf; ComponentLink2Description: http://www.farnell.com/datasheets/2178762.pdf; Supplier Part Number 1: 2008343
TP1 TP2 = TestPoint: TEST POINT ROUND SMD; FIT: 0.94; Komp / Device: SMD; ComponentLink1Description: Datasheet
U12 = RF - UBLOX-SAM-M8Q: SAM-M8 RF Receiver BeiDou, Galileo, GLONASS, GNSS, GPS -160dBm; Manufacturer: u-blox; Manufacturer Part Number: MAX-M8Q-0; Stock 1: 10805; Supplier 1: Digi-Key; Supplier Part Number 1: 672-1054-1-ND
U13 = SEN - BME280: Humidity Temperature Sensor 0 ~ 100% RH I²C, SPI ±3% 1s Surface Mount; ComponentLink1Description: Datasheet; ComponentLink1URL: https://ae-bst.resource.bosch.com/media/_tech/media/datasheets/BST-BME280-DS002.pdf; Supplier 1: Digi-Key; Supplier Part Number 1: 828-1063-6-ND
U14 U15 = T_M - DMG6602SVT: Dual MOSFET, N and P Channel, 3.4 A, 30 V, 0.038 ohm, 10 V, 1 V; ComponentLink1Description: Datasheet; ComponentLink1URL: http://www.farnell.com/datasheets/1915929.pdf?_ga=2.95290844.1984085946.1565589483-1741076818.1563951383; Supplier 1: Farnell; Supplier Part Number 1: 2061522

## Sheet PAGE2 -MCU.SchDoc
size A3; DocumentNumber: 1; SheetNumber: 2; SheetTotal: 2
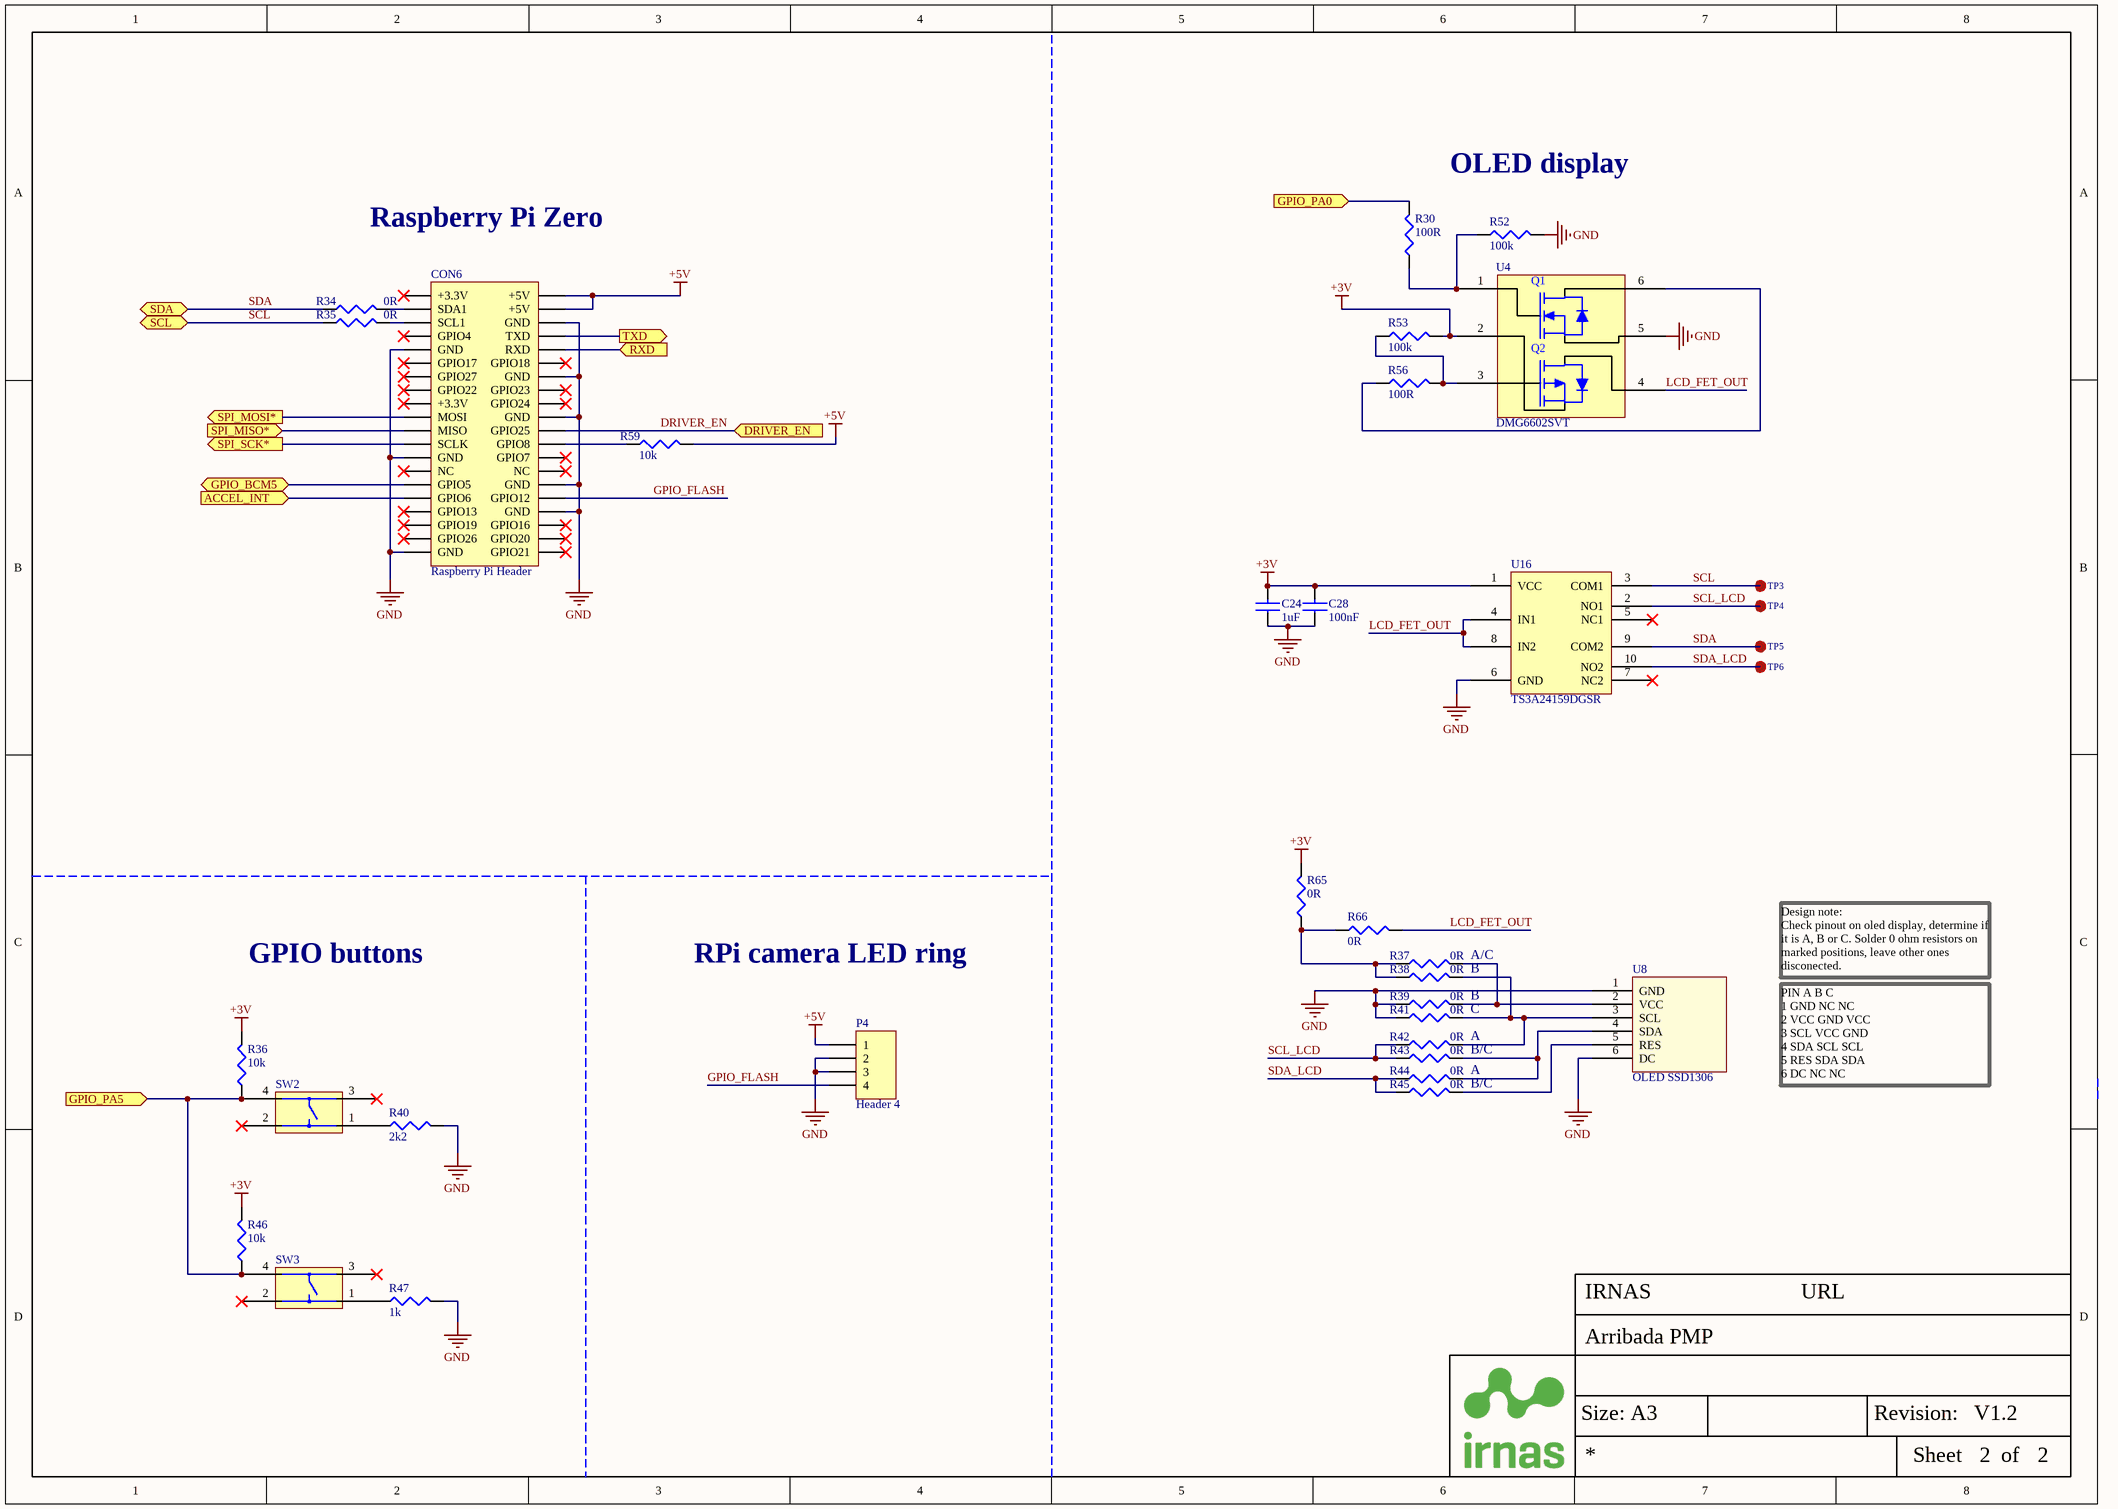
[diagram p3: PAGE2 -MCU.SchDoc]

### Parts
C24  1uF  [CAP0603]
C28  100nF  [CAP0603]
CON6  Raspberry Pi Header  [HDR2X20]
P4  Header 4  [HDR1X4]
R30  100R  [RES0603]
R34  0R  [RES0603]
R35  0R  [RES0603]
R36  10k  [RES0603]
R37  0R  [RES0603]
R38  0R  [RES0603]
R39  0R  [RES0603]
R40  2k2  [RES0603]
R41  0R  [RES0603]
R42  0R  [RES0603]
R43  0R  [RES0603]
R44  0R  [RES0603]
R45  0R  [RES0603]
R46  10k  [RES0603]
R47  1k  [RES0603]
R52  100k  [RES0603]
R53  100k  [RES0603]
R56  100R  [RES0603]
R59  10k  [RES0603]
R65  0R  [RES0603]
R66  0R  [RES0603]
SW2  BTN - B3F-1070  [BTN B3F-1070]  (value not drawn)
SW3  BTN - B3F-1070  [BTN B3F-1070]  (value not drawn)
TP3  TestPoint  [TestPoint:1.2x1.2mm]  (value not drawn)
TP4  TestPoint  [TestPoint:1.2x1.2mm]  (value not drawn)
TP5  TestPoint  [TestPoint:1.2x1.2mm]  (value not drawn)
TP6  TestPoint  [TestPoint:1.2x1.2mm]  (value not drawn)
U4  DMG6602SVT  [TSOT26]
U8  OLED SSD1306  [OLED SSD1306]
U16  TS3A24159DGSR  [VSSOP-10]

### Ports
ACCEL_INT (in), DRIVER_EN (in), GPIO_BCM5 (bidir), GPIO_PA0 (in), GPIO_PA5 (in), RXD (in), SCL (bidir), SDA (bidir), SPI_MISO* (in), SPI_MOSI* (out), SPI_SCK* (out), TXD (out)

### Nets
+3V: C24.2 C28.2 R36.2 R46.2 R53.2 R65.2 U4.2(S2) U16.1(VCC)
+5V: CON6.2(+5V) CON6.4(+5V) P4.1 R59.2
GND: C24.1 C28.1 CON6.6(GND) CON6.9(GND) CON6.14(GND) CON6.20(GND) CON6.25(GND) CON6.30(GND) CON6.34(GND) CON6.39(GND) P4.2 P4.3 R39.1 R40.2 R41.1 R47.2 R52.2 U4.5(S1) U8.1(GND) U8.6(DC) U16.6(GND)
ACCEL_INT: CON6.31(GPIO6) ; port ACCEL_INT
DRIVER_EN: CON6.22(GPIO25) ; port DRIVER_EN
GPIO_BCM5: CON6.29(GPIO5) ; port GPIO_BCM5
GPIO_FLASH: CON6.32(GPIO12) P4.4
GPIO_PA0: R30.2 ; port GPIO_PA0
GPIO_PA5: R36.1 R46.1 SW2.4 SW3.4 ; port GPIO_PA5
LCD_FET_OUT: R66.2 U4.4(D2) U16.4(IN1) U16.8(IN2)
RXD_RPI: CON6.10(RXD) ; port RXD
SCL: R35.1 TP3.0 U16.3(COM1) ; port SCL
SCL_LCD: R42.1 R43.1 TP4.0 U16.2(NO1)
SDA: R34.1 TP5.0 U16.9(COM2) ; port SDA
SDA_LCD: R44.1 R45.1 TP6.0 U16.10(NO2)
SPI_MISO: CON6.21(MISO) ; port SPI_MISO*
SPI_MOSI: CON6.19(MOSI) ; port SPI_MOSI*
SPI_SCK: CON6.23(SCLK) ; port SPI_SCK*
TXD_RPI: CON6.8(TXD) ; port TXD
NetCON6_3: CON6.3(SDA1) R34.2
NetCON6_5: CON6.5(SCL1) R35.2
NetCON6_24: CON6.24(GPIO8) R59.1
NetR30_1: R30.1 R52.1 U4.1(G1)
NetR37_1: R37.1 R38.1 R65.1 R66.1
NetR37_2: R37.2 R39.2 U8.2(VCC)
NetR38_2: R38.2 R41.2 R42.2 U8.3(SCL)
NetR40_1: R40.1 SW2.1
NetR43_2: R43.2 R44.2 U8.4(SDA)
NetR45_2: R45.2 U8.5(RES)
NetR47_1: R47.1 SW3.1
NetR53_1: R53.1 R56.2 U4.3(G2)
NetR56_1: R56.1 U4.6(D1)

Not connected (* = marked no-connect by the designer): CON6 1(+3.3V)* 7(GPIO4)* 11(GPIO17)* 12(GPIO18)* 13(GPIO27)* 15(GPIO22)* 16(GPIO23)* 17(+3.3V)* 18(GPIO24)* 26(GPIO7)* 27(NC)* 28(NC)* 33(GPIO13)* 35(GPIO19)* 36(GPIO16)* 37(GPIO26)* 38(GPIO20)* 40(GPIO21)*; SW2 2* 3*; SW3 2* 3*; U16 5(NC1)* 7(NC2)*

### Notes on the sheet
- OLED display
- Raspberry Pi Zero
- GPIO buttons
- RPi camera LED ring
- A/C
- B
- Design note:
  Check pinout on oled display, determine if it is A, B or C. Solder 0 ohm resistors on marked positions, leave other ones disconected.
- C
- A
- B/C
- PIN	A	B	C
  1	GND	NC	NC
  2	VCC	GND	VCC
  3	SCL	VCC	GND
  4	SDA	SCL	SCL
  5	RES	SDA	SDA
  6	DC	NC	NC
- Size: A3
- Revision:
- Sheet
- of
- (in symbol T_M - DMG6602SVT) Q1; Q2

### Library data of the parts
C24 = C - 1uF: as C27 on sheet PAGE4 - SENSORS; Supplier 1: Farnell; Manufacturer: MURATA; Manufacturer Part Number: GRM188R61H105KAALD; RoHS: YES; Stock 1: 62682; Pricing 1: 10=0.093, 100=0.062, 500=0.0507, 1000=0.0465, 2000=0.0429, 4000=0.0399, 20000=0.0372, 40000=0.0365 (GBP); Packaging: Cut Tape; Operating Temperature Min: -55; Operating Temperature Max: 85; Automotive Qualification Standard: -; MSL: -; Capacitance Tolerance ±: ± 10%; ComponentLink1URL: http://www.farnell.com/datasheets/2048611.pdf; ComponentLink1Description: http://www.farnell.com/datasheets/2048611.pdf; Supplier Part Number 1: 1845736
C28 = C - 100nF: as C22 on sheet PAGE4 - SENSORS; Supplier 1: Farnell; Manufacturer: MURATA; Manufacturer Part Number: GRM188R71C104KA01J; RoHS: YES; Stock 1: 18297; Pricing 1: 10=0.0145, 100=0.0126, 500=0.0081, 2500=0.0059, 5000=0.0052, 10000=0.0046, 50000=0.0036, 100000=0.0035 (GBP); Packaging: Cut Tape; Operating Temperature Min: -55; Operating Temperature Max: 125; Automotive Qualification Standard: -; MSL: MSL 1 - Unlimited; ComponentLink1URL: http://www.farnell.com/datasheets/2189124.pdf; ComponentLink1Description: http://www.farnell.com/datasheets/2189124.pdf; Supplier Part Number 1: 2688519
CON6 = Raspberry Pi Header: Header, 20-Pin, Dual row; LatestRevisionDate: 17-Jul-2002; LatestRevisionNote: Re-released for DXP Platform.; Publisher: Altium Limited; Supplier Part Number 1: RPi header
P4 = Header 4: Header, 4-Pin; LatestRevisionDate: 17-Jul-2002; LatestRevisionNote: Re-released for DXP Platform.; Publisher: Altium Limited; Supplier Part Number 1: Header 2.54 mm
R30 R56 = R - 100R: as R62 on sheet PAGE3 - POWER; Supplier 1: Farnell; Manufacturer: MULTICOMP; Manufacturer Part Number: MC0063W06031100R; RoHS: Y-EX; Stock 1: 78152; Pricing 1: 10=0.0011, 100=0.001, 500=0.0009, 1000=0.0008, 2500=0.0007 (GBP); Resistance Tolerance: ± 1%; Packaging: Cut Tape; Resistor Element Material: Thick Film; Automotive Qualification Standard: -; Operating Temperature Max: 155; Operating Temperature Min: -55; Operating Temperature Range: -55°C to +155; Tape Width: 8; Temperature Coeff. -: 200; Tolerance +: 1%; Tolerance -: 1%; ComponentLink1URL: http://www.farnell.com/datasheets/1788326.pdf; ComponentLink1Description: http://www.farnell.com/datasheets/1788326.pdf; ComponentLink2URL: http://www.farnell.com/cad/1561149.zip; ComponentLink2Description: http://www.farnell.com/cad/1561149.zip; ComponentLink3URL: http://www.farnell.com/datasheets/2289252.pdf; ComponentLink3Description: http://www.farnell.com/datasheets/2289252.pdf; Supplier Part Number 1: 9330364
R34 R35 R37-R39 R41-R45 R65 R66 = R - 0R: as R17 on sheet PAGE1 - MAIN; Supplier 1: Farnell; Manufacturer: BOURNS; Manufacturer Part Number: CR0603-J/-000ELF; RoHS: YES; Stock 1: 58200; Pricing 1: 10=0.0146, 250=0.0097, 1000=0.0073, 5000=0.0049, 12500=0.0042 (GBP); Resistance Tolerance: ± 5%; Packaging: Cut Tape; Resistor Element Material: Thick Film; Temperature Coefficient: -; Automotive Qualification Standard: -; MSL: MSL 1 - Unlimited; ComponentLink1URL: http://www.bourns.com/engineering/CHPREZTR/cr0603.stp; ComponentLink1Description: http://www.bourns.com/engineering/CHPREZTR/cr0603.stp; ComponentLink2URL: http://www.farnell.com/datasheets/2178762.pdf; ComponentLink2Description: http://www.farnell.com/datasheets/2178762.pdf; Supplier Part Number 1: 2008343
R36 R46 R59 = R - 10k: MULTICOMP - MCMR06X103 JTL - RES, CERAMIC, 10K, 5%, 0.1W, 0603; IRNAS Part No.: I-100008; Resistance: 10; Voltage Rating: 75; Resistor Case Style: 0603 [1608 Metric]; Power Rating: 100; Product Range: MCMR Series; Temperature Coefficient: ± 100; Automotive Qualification Standard: -<!--FANDB--><div class="features-and-benefits-container"><div class="features-and-benefits-description"><span class="features-benefits-value">The Multicomp MCMR series resistors are automotive grade, anti sulphured thick film chip resistor. The resistance range includes E24 and E96 decade values from 1ohm to 10Mohm. These resistors are constructed on top of a high grade ceramic body.</span></div><div class="features-and-benefits-list"><ul class="features-and-benefits-list-list"><li class="features-and-benefits-list-item">EIA 0402, 0603, 0805, 1206 chip sizes available</li><li class="features-and-benefits-list-item">High reliability and stability</li><li class="features-and-benefits-list-item">Automotive grade AEC-Q200 compliant</li><li class="features-and-benefits-list-item">Complaint with (IEC 60068-1) 55/155/56 climatic category</li><li class="features-and-benefits-list-item">Maximum operation voltage of 50V, 75V, 150V and 200V</li><li class="features-and-benefits-list-item">Power rating of 62.5mW, 100mW, 125mW and 250mW</li><li class="features-and-benefits-list-item">Available in ±1% and ±5% tolerance</li><li class="features-and-benefits-list-item">Temperature coefficient (TCR) of +200ppm/°C, +100ppm/°C and -200ppm/°C to +400ppm/°C</li><li class="features-and-benefits-list-item">Operating temperature range -55°C to 155; Supplier 1: Farnell; Manufacturer: MULTICOMP; Manufacturer Part Number: MCMR06X103 JTL; RoHS: Y-EX; Stock 1: 19791; Pricing 1: 10=0.0087, 100=0.0074, 500=0.0061, 1000=0.0048, 2500=0.0032, 5000=0.0024, 25000=0.0016, 50000=0.0013 (GBP); Resistance Tolerance: ± 5%; Packaging: Cut Tape; Resistor Element Material: Ceramic; ComponentLink1URL: http://www.farnell.com/datasheets/1716707.pdf; ComponentLink1Description: http://www.farnell.com/datasheets/1716707.pdf; Supplier Part Number 1: 2073356
R40 = R - 2k2: MULTICOMP - MCMR06X2201FTL - RES, CERAMIC, 2K2, 1%, 0.1W, 0603; IRNAS Part No.: I-100024; Supplier 1: Farnell; Manufacturer: MULTICOMP; Manufacturer Part Number: MCMR06X2201FTL; RoHS: Y-EX; Stock 1: 17638; Pricing 1: 10=0.0099, 100=0.0059, 500=0.0042, 1000=0.0033, 2500=0.0027 (GBP); ComponentLink1URL: http://www.farnell.com/datasheets/1716707.pdf; ComponentLink1Description: http://www.farnell.com/datasheets/1716707.pdf; Supplier Part Number 1: 2073429
R47 = R - 1k: MULTICOMP - MCMR06X102 JTL - RES, CERAMIC, 1K, 5%, 0.1W, 0603; IRNAS Part No.: I-100042; Resistance: 1; Voltage Rating: 75; Resistor Case Style: 0603 [1608 Metric]; Power Rating: 100; Product Range: MCMR Series; Temperature Coefficient: ± 100; Resistor Mounting: Surface Mount Device<!--FANDB--><div class="features-and-benefits-container"><div class="features-and-benefits-description"><span class="features-benefits-value">The Multicomp MCMR series resistors are automotive grade, anti sulphured thick film chip resistor. The resistance range includes E24 and E96 decade values from 1ohm to 10Mohm. These resistors are constructed on top of a high grade ceramic body.</span></div><div class="features-and-benefits-list"><ul class="features-and-benefits-list-list"><li class="features-and-benefits-list-item">EIA 0402, 0603, 0805, 1206 chip sizes available</li><li class="features-and-benefits-list-item">High reliability and stability</li><li class="features-and-benefits-list-item">Automotive grade AEC-Q200 compliant</li><li class="features-and-benefits-list-item">Complaint with (IEC 60068-1) 55/155/56 climatic category</li><li class="features-and-benefits-list-item">Maximum operation voltage of 50V, 75V, 150V and 200V</li><li class="features-and-benefits-list-item">Power rating of 62.5mW, 100mW, 125mW and 250mW</li><li class="features-and-benefits-list-item">Available in ±1% and ±5% tolerance</li><li class="features-and-benefits-list-item">Temperature coefficient (TCR) of +200ppm/°C, +100ppm/°C and -200ppm/°C to +400ppm/°C</li><li class="features-and-benefits-list-item">Operating temperature range -55°C to 155; Supplier 1: Farnell; Manufacturer: MULTICOMP; Manufacturer Part Number: MCMR06X102 JTL; RoHS: Y-EX; Stock 1: 18133; Pricing 1: 10=0.0089, 100=0.0076, 500=0.0063, 1000=0.0049, 2500=0.0033, 5000=0.0024, 25000=0.0016, 50000=0.0013 (GBP); Resistance Tolerance: ± 5%; Packaging: Cut Tape; Resistor Element Material: Ceramic; Automotive Qualification Standard: -; ComponentLink1URL: http://www.farnell.com/datasheets/1716707.pdf; ComponentLink1Description: http://www.farnell.com/datasheets/1716707.pdf; Supplier Part Number 1: 2073354
R52 R53 = R - 100k: as R49 on sheet PAGE4 - SENSORS; Supplier 1: Farnell; Manufacturer: MULTICOMP; Manufacturer Part Number: MCMR06X104 JTL; RoHS: Y-EX; Stock 1: 187; Pricing 1: 10=0.0109, 100=0.0085, 500=0.006, 1000=0.0048, 2500=0.004, 5000=0.003, 25000=0.002, 50000=0.0016 (GBP); Power Rating: 100; Resistance Tolerance: ± 5%; Packaging: Cut Tape; Resistor Element Material: Ceramic; Automotive Qualification Standard: -; ComponentLink1URL: http://www.farnell.com/datasheets/1716707.pdf; ComponentLink1Description: http://www.farnell.com/datasheets/1716707.pdf; Supplier Part Number 1: 2073357
SW2 SW3 = BTN - B3F-1070: Tactile Switch, B3F Series, Top Actuated, Through Hole, Round Button, 100 gf, 50mA at 24VDC; ComponentLink1Description: Datasheet; ComponentLink1URL: https://4donline.ihs.com/images/VipMasterIC/IC/OMRN/OMRN-S-A0001309768/OMRN-S-A0001309768-1.pdf?hkey=52A5661711E402568146F3353EA87419; Supplier 1: Farnell; Supplier Part Number 1: 959698
TP3-TP6 = TestPoint: TEST POINT ROUND SMD; FIT: 0.94; Komp / Device: SMD; ComponentLink1Description: Datasheet
U4 = T_M - DMG6602SVT: as U14 on sheet PAGE4 - SENSORS; ComponentLink1Description: Datasheet; ComponentLink1URL: http://www.farnell.com/datasheets/1915929.pdf?_ga=2.95290844.1984085946.1565589483-1741076818.1563951383; Supplier 1: Farnell; Supplier Part Number 1: 2061522
U16 = INT - TS3A24159DGSR: Analogue Switch, 2 Channels, SPDT, 0.34 ohm, 1.65V to 3.6V, VSSOP, 10 Pins; Supplier 1: Farnell; Supplier Part Number 1: 3118263; ComponentLink1Description: Datasheet; ComponentLink1URL: https://www.ti.com/lit/ds/symlink/ts3a24159.pdf?HQS=TI-null-null-mousermode-df-pf-null-wwe&ts=1604495897645&ref_url=https%253A%252F%252Fwww.mouser.de%252F
U8 = OLED SSD1306: Supplier Part Number 1: OLED SSD 1306 display

## Nets that join several sheets
+3V: PAGE4 - SENSORS (6 pins), PAGE2 -MCU (8 pins)
GND: PAGE1 - MAIN (L3.1 L4.1 L5.1), PAGE3 - POWER (7 pins), PAGE4 - SENSORS (20 pins), PAGE2 -MCU (21 pins)
RXD_RPI: PAGE1 - MAIN (R18.2 R20.2), PAGE2 -MCU (CON6.10)
SCL: PAGE4 - SENSORS (U13.4), PAGE2 -MCU (R35.1 TP3.0 U16.3)
SDA: PAGE4 - SENSORS (U13.3), PAGE2 -MCU (R34.1 TP5.0 U16.9)
SPI_MISO: PAGE4 - SENSORS (CON8.3), PAGE2 -MCU (CON6.21)
SPI_MOSI: PAGE4 - SENSORS (CON8.2), PAGE2 -MCU (CON6.19)
SPI_SCK: PAGE4 - SENSORS (CON8.4), PAGE2 -MCU (CON6.23)
TXD_RPI: PAGE1 - MAIN (R17.2 R19.1), PAGE2 -MCU (CON6.8)

## Assembly variants
BASIC: not fitted C16 L3 L4 R30 R34 R35 R38 R39 R42 R44 R64 R65